# EAGLE design mixer_lfo_pots (EAGLE 7.6.0)
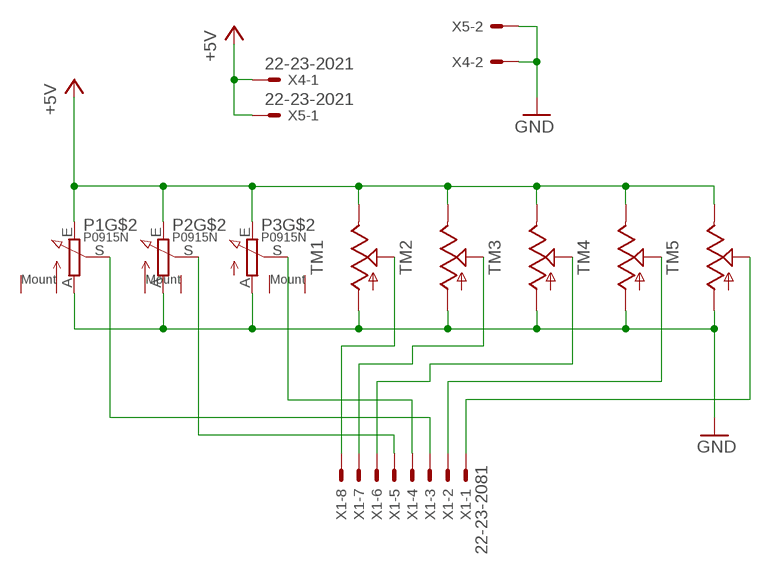
[diagram p0: schematic, sheet 1]

## Parts
P1  P0915N  [P0915N]
P2  P0915N  [P0915N]
P3  P0915N  [P0915N]
TM1  TRIMSLIDE60  [SLIDEPOT-60]
TM2  TRIMSLIDE60  [SLIDEPOT-60]
TM3  TRIMSLIDE60  [SLIDEPOT-60]
TM4  TRIMSLIDE60  [SLIDEPOT-60]
TM5  TRIMSLIDE60  [SLIDEPOT-60]
X1  22-23-2081  [22-23-2081]
X4  22-23-2021  [22-23-2021]
X5  22-23-2021  [22-23-2021]

## Nets
+5V: P1.E P2.E P3.E TM1.B TM2.B TM3.B TM4.B TM5.B X4.1 X5.1
GND: P1.A P2.A P3.A TM1.A TM2.A TM3.A TM4.A TM5.A X4.2 X5.2
N$1: P1.S X1.3
N$2: P2.S X1.5
N$3: P3.S X1.4
N$4: TM1.WIPER X1.8
N$5: TM2.WIPER X1.7
N$6: TM3.WIPER X1.6
N$7: TM4.WIPER X1.2
N$8: TM5.WIPER X1.1
Unconnected: P1.GND@1(GND) P1.GND@2(GND) P2.GND@1(GND) P2.GND@2(GND) P3.GND@1(GND) P3.GND@2(GND)

## Library data of the parts
P1-P3 = pot-tt_electronics:P0915N
TM1-TM5 = stefan-lochbrunner_EAGLE_master_custom%20libraries_potentiometers_Bourns%20PTA%20series_Bourns%20PTA%20series:TRIM: Sliding potentiometers Based on Adafruits (https://github.com/adafruit/Adafruit-Eagle-Library) 'TRIM' device. For Bourns PTA series and TT Electronics PSxx series potentiometers.
X1 = con-molex:22-23-2081: .100" (2.54mm) Center Header - 8 Pin; MF: MOLEX; MPN: 22-23-2081; OC_FARNELL: 1756826; OC_NEWARK: 01C7592
X4 X5 = con-molex:22-23-2021: .100" (2.54mm) Center Header - 2 Pin; MF: MOLEX; MPN: 22-23-2021; OC_FARNELL: 1462926; OC_NEWARK: 25C3832

## Board
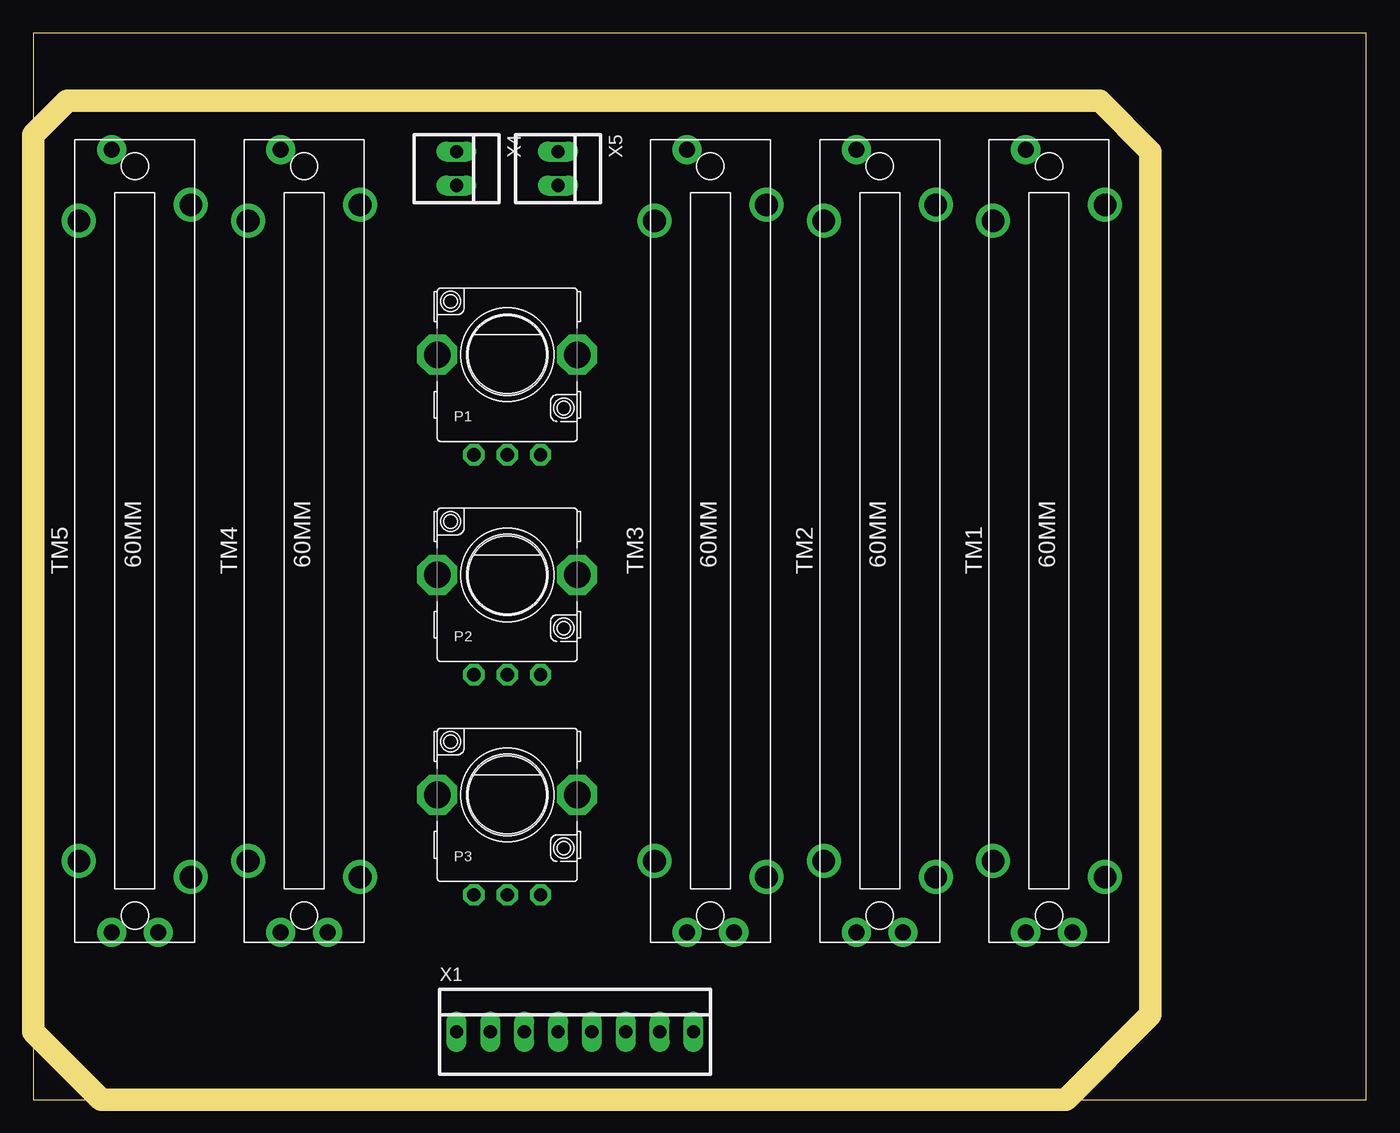
[diagram p1: board, top side]
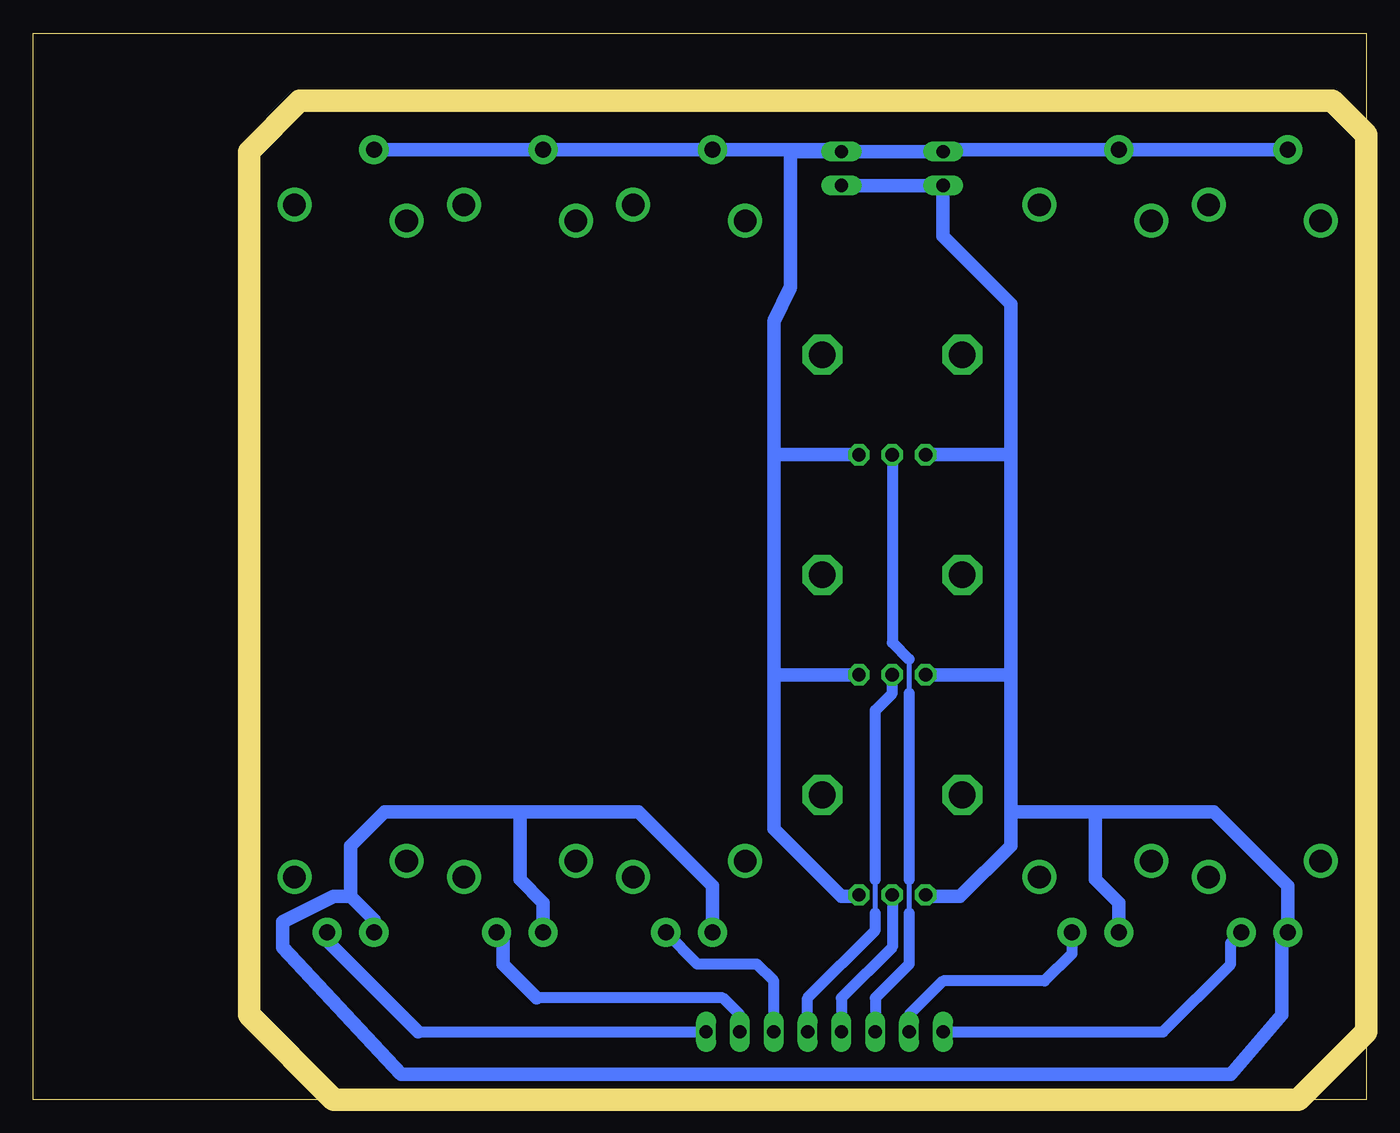
[diagram p2: board, bottom side, seen from below]

Size 100 x 80 mm. Coordinates in mm from the lower left corner, seen from the top.
Outline: 0,0 100,0 100,80 0,80 0,0
Copper layers (1*16): Top 0.035mm / dielectric 1.5mm / Bottom 0.035mm
Design rules "default *": minimum track width 16mil, minimum drill 31mil, track to track 12mil, track to pad 12mil, pad to pad 12mil, via to via 12mil, smd to smd 8mil, copper to edge 0mil, drill to drill 16mil, minimum pad ring 10mil, minimum via ring 8mil, stop-mask expansion 4mil, vias tented up to drill 0mil, thermal gap 10mil
Milling: 8 lines

### Footprints (pad centres in the part's own frame; a part is rotated, then mirrored left to right if it is on the bottom)
P0915N = drill 1 pad 1.6 octagon: A -2.5,-7.5; E 2.5,-7.5; S 0,-7.5 | drill 2 pad 3 octagon: GND@1 -5.25,0; GND@2 5.25,0
SLIDEPOT-60 = drill 1.2 pad 2.184: A -29.37,1.75; B 29.37,1.75; WIPER -29.37,-1.75 | drill 1.7 pad 2.54: P$1 -24.02,4.2; P$2 24.02,4.2; P$3 -25.22,-4.2; P$4 25.22,-4.2
22-23-2081 = drill 1 long: 1 -8.89,0; 2 -6.35,0; 3 -3.81,0; 4 -1.27,0; 5 1.27,0; 6 3.81,0; 7 6.35,0; 8 8.89,0
22-23-2021 = drill 1 long: 1 -1.27,0; 2 1.27,0

### Placement (x,y rotation side)
P1  35.56,55.88 0 top
P2  35.56,39.37 0 top
P3  35.56,22.86 0 top
TM1  76.2,41.91 90 top
TM2  63.5,41.91 90 top
TM3  50.8,41.91 90 top
TM4  20.32,41.91 90 top
TM5  7.62,41.91 90 top
X1  40.64,5.08 0 top
X4  31.75,69.85 270 top
X5  39.37,69.85 270 top

### Tracks (layer width: path | path; a pad name or v marks a point on that pad's centre or on a via)
+5V
  Bottom 0.813: 31.59,71.28 X4.1 | 39.53,71.28 X5.1 | 38.18,15.24 P3.E | 44.33,31.87 44.45,31.75 | 44.33,48.38 44.45,48.26 | TM4.B 18.89,71.28 19.05,71.12 18.73,71.12 TM4.B
  Bottom 1.016: TM5.B TM4.B 31.59,71.28 | 39.53,71.28 TM3.B TM2.B TM1.B | X4.1 X5.1 43.18,71.12 43.18,60.96 44.45,58.42 44.45,48.26 44.45,31.75 44.45,20.32 39.37,15.24 38.18,15.24 | P2.E 44.33,31.87 | P1.E 44.33,48.38
GND
  Bottom 0.813: 32.94,15.24 P3.A | 26.79,31.87 26.67,31.75 | 26.79,48.38 26.67,48.26 | TM1.A 74.45,13.49 | 6.35,12.06 TM5.A
  Bottom 1.016: X5.2 X4.2 31.75,64.77 26.67,59.69 26.67,48.26 26.67,31.75 26.67,21.59 | 26.67,21.59 26.67,19.05 30.48,15.24 32.94,15.24 | P2.A 26.79,31.87 | P1.A 26.79,48.38 | TM5.A 5.87,16.03 11.43,21.59 20.32,21.59 | 20.32,21.59 26.67,21.59 | TM4.A 18.57,14.76 20.32,16.51 20.32,21.59 | 74.45,13.49 76.2,15.24 | 76.2,15.24 77.47,15.24 81.28,13.34 81.28,11.43 72.39,1.91 10.16,1.91 6.35,6.35 6.35,12.06 | TM3.A 49.05,16.03 54.61,21.59 63.5,21.59 | 63.5,21.59 73.66,21.59 76.2,19.05 76.2,15.24 | TM2.A 61.75,14.76 63.5,16.51 63.5,21.59
N$1
  Bottom 0.381: 34.29,33.02 34.29,30.48 | 34.29,16.51 34.29,13.97
  Bottom 0.813: P1.S 35.56,34.29 34.29,33.02 | X1.3 36.83,7.62 34.29,10.16 34.29,13.97 | 34.29,30.48 34.29,16.51
N$2
  Bottom 0.381: 36.83,13.97 36.83,16.51
  Bottom 0.813: X1.5 41.91,7.62 36.83,12.7 36.83,13.97 | P2.S 35.56,30.48 36.83,29.21 36.83,16.51
N$3
  Bottom 0.813: P3.S 35.56,11.43 39.37,7.62 X1.4
N$4
  Bottom 0.813: 71.12,5.08 X1.8
  Bottom 1.016: TM1.WIPER 77.95,11.91 71.12,5.08
N$5
  Bottom 0.813: X1.7 46.99,6.35 48.26,7.62 62.23,7.62 | 64.77,12.06 TM2.WIPER
  Bottom 1.016: 62.23,7.62 64.77,10.16 64.77,12.06
N$6
  Bottom 0.813: X1.6 44.45,8.89 45.72,10.16 50.17,10.16 TM3.WIPER
N$7
  Bottom 0.813: TM4.WIPER 22.07,10.95 24.13,8.89 31.75,8.89 34.29,6.35 X1.2
N$8
  Bottom 0.813: X1.1 15.24,5.08 10.16,10.16 10.16,11.75 TM5.WIPER